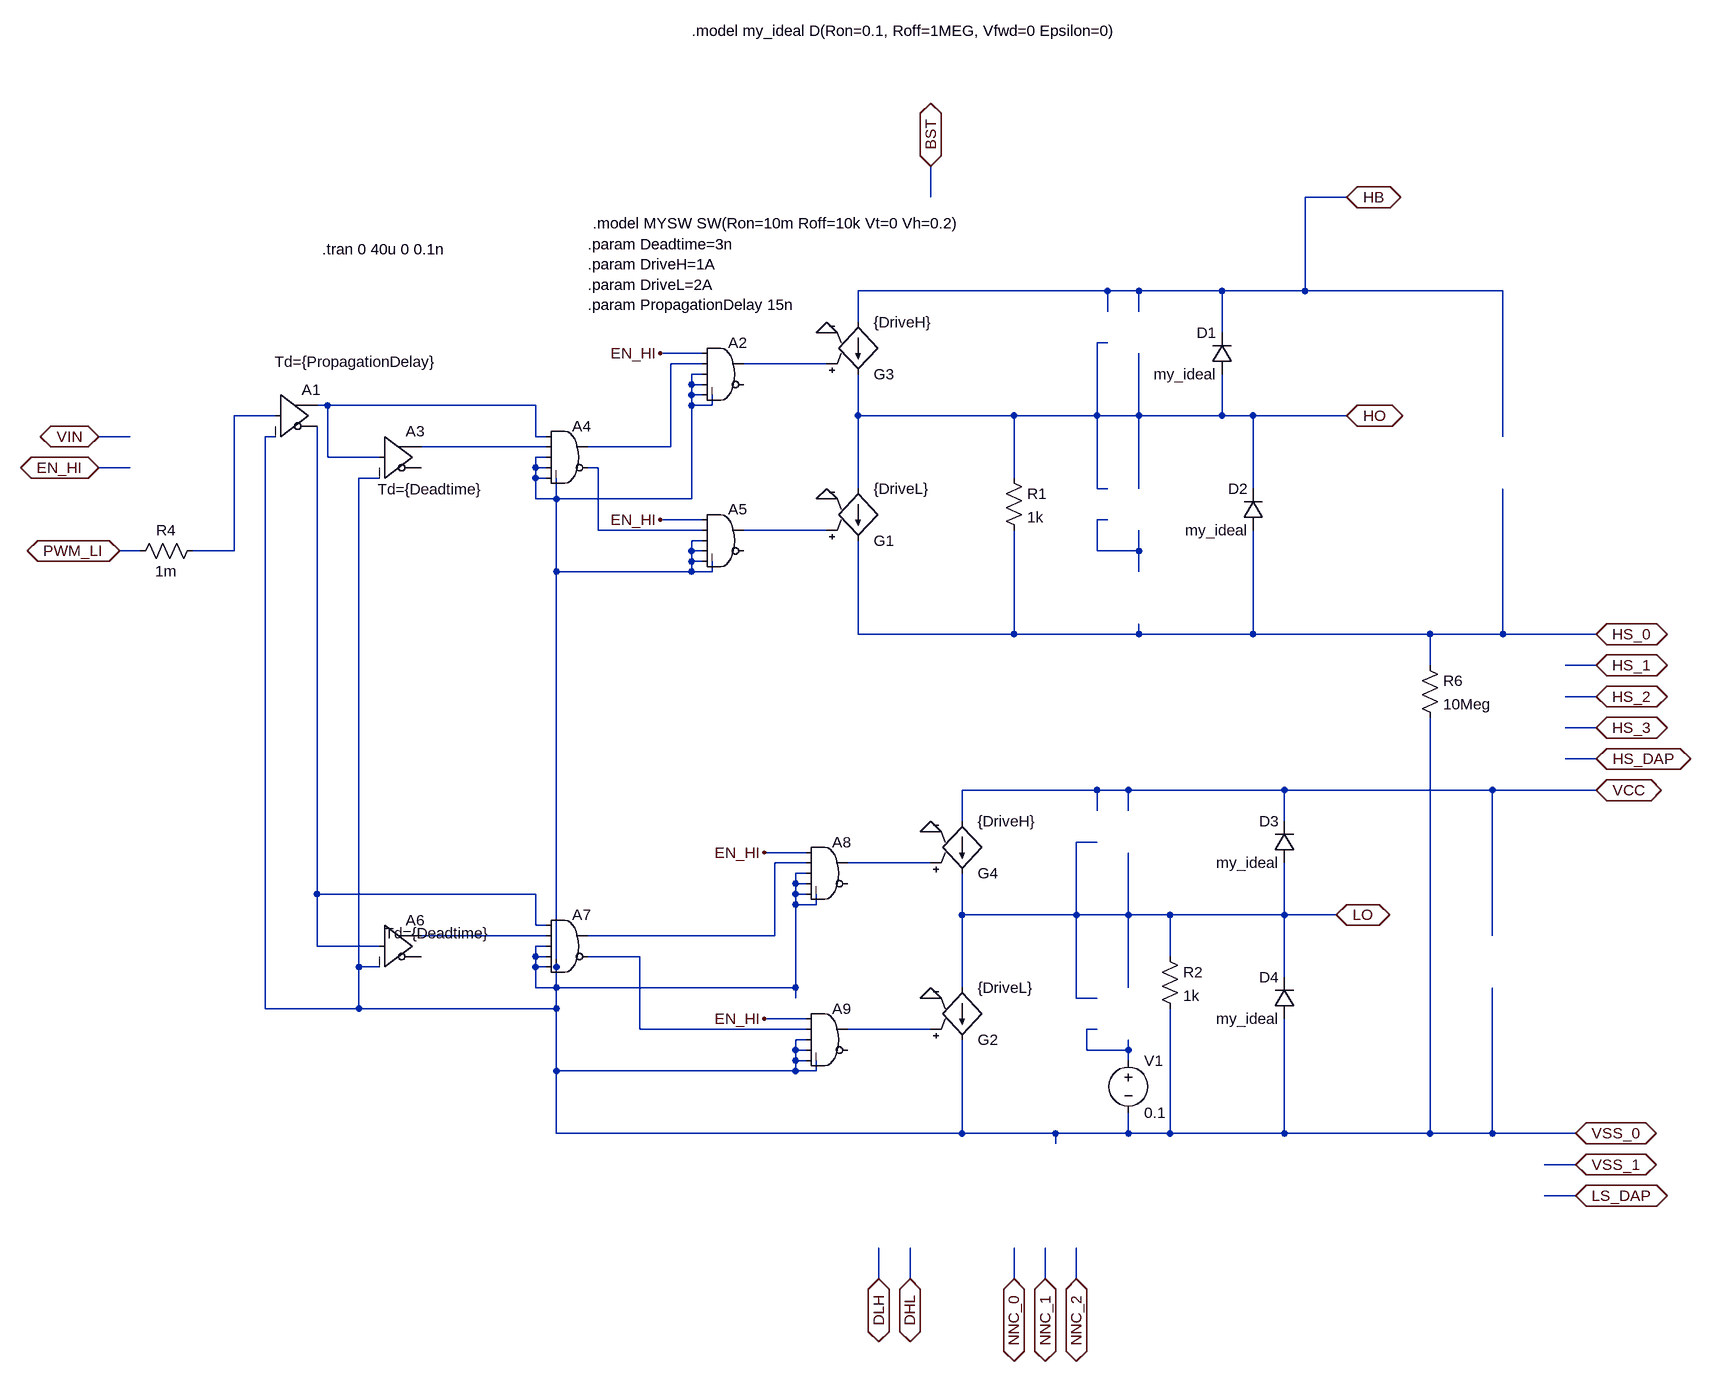
[diagram p0: schematic LMG1210-simple2.asc]
LMG1210-simple2.asc, the LTspice schematic file:
Version 4
SHEET 1 2328 1960
WIRE 912 -288 912 -336
WIRE 1552 -288 1488 -288
WIRE 1184 -144 800 -144
WIRE 1232 -144 1184 -144
WIRE 1360 -144 1232 -144
WIRE 1488 -144 1488 -288
WIRE 1488 -144 1360 -144
WIRE 1792 -144 1488 -144
WIRE 1184 -112 1184 -144
WIRE 1232 -112 1232 -144
WIRE 800 -96 800 -144
WIRE 1360 -80 1360 -144
WIRE 1184 -64 1168 -64
WIRE 560 -48 496 -48
WIRE 560 -32 512 -32
WIRE 752 -32 624 -32
WIRE 560 -16 544 -16
WIRE 544 0 544 -16
WIRE 560 0 544 0
WIRE 544 16 544 0
WIRE 560 16 544 16
WIRE -16 32 -32 32
WIRE 304 32 -16 32
WIRE 544 32 544 16
WIRE 576 32 576 16
WIRE 576 32 544 32
WIRE -96 48 -160 48
WIRE 800 48 800 -16
WIRE 1040 48 800 48
WIRE 1168 48 1168 -64
WIRE 1168 48 1040 48
WIRE 1232 48 1232 -48
WIRE 1232 48 1168 48
WIRE 1360 48 1360 -16
WIRE 1360 48 1232 48
WIRE 1408 48 1360 48
WIRE 1552 48 1408 48
WIRE -320 80 -368 80
WIRE -96 80 -112 80
WIRE 304 80 304 32
WIRE 320 80 304 80
WIRE 1792 80 1792 -144
WIRE 320 96 128 96
WIRE 512 96 512 -32
WIRE 512 96 384 96
WIRE -16 112 -16 32
WIRE 64 112 -16 112
WIRE 320 112 304 112
WIRE -320 128 -368 128
WIRE 304 128 304 112
WIRE 320 128 304 128
WIRE 400 128 384 128
WIRE 64 144 32 144
WIRE 304 144 304 128
WIRE 320 144 304 144
WIRE 1040 144 1040 48
WIRE 800 160 800 48
WIRE 1168 160 1168 48
WIRE 1184 160 1168 160
WIRE 1232 160 1232 48
WIRE 1408 160 1408 48
WIRE 304 176 304 144
WIRE 336 176 336 144
WIRE 336 176 304 176
WIRE 544 176 544 32
WIRE 544 176 336 176
WIRE 560 208 496 208
WIRE 1184 208 1168 208
WIRE 400 224 400 128
WIRE 560 224 400 224
WIRE 752 224 624 224
WIRE 560 240 544 240
WIRE -304 256 -336 256
WIRE -160 256 -160 48
WIRE -160 256 -224 256
WIRE 544 256 544 240
WIRE 560 256 544 256
WIRE 1168 256 1168 208
WIRE 1232 256 1232 224
WIRE 1232 256 1168 256
WIRE 544 272 544 256
WIRE 560 272 544 272
WIRE 336 288 336 176
WIRE 544 288 544 272
WIRE 544 288 336 288
WIRE 576 288 576 272
WIRE 576 288 544 288
WIRE 1232 288 1232 256
WIRE 800 384 800 240
WIRE 1040 384 1040 224
WIRE 1040 384 800 384
WIRE 1232 384 1232 368
WIRE 1232 384 1040 384
WIRE 1408 384 1408 224
WIRE 1408 384 1232 384
WIRE 1680 384 1408 384
WIRE 1792 384 1792 160
WIRE 1792 384 1680 384
WIRE 1936 384 1792 384
WIRE 1680 432 1680 384
WIRE 1936 432 1888 432
WIRE 1936 480 1888 480
WIRE 1936 528 1888 528
WIRE 1936 576 1888 576
WIRE 1168 624 960 624
WIRE 1216 624 1168 624
WIRE 1456 624 1216 624
WIRE 1776 624 1456 624
WIRE 1936 624 1776 624
WIRE 1168 656 1168 624
WIRE 1216 656 1216 624
WIRE 960 672 960 624
WIRE 1456 672 1456 624
WIRE 1168 704 1136 704
WIRE 720 720 656 720
WIRE 720 736 672 736
WIRE 912 736 784 736
WIRE 720 752 704 752
WIRE 704 768 704 752
WIRE 720 768 704 768
WIRE -32 784 -32 64
WIRE 304 784 -32 784
WIRE 704 784 704 768
WIRE 720 784 704 784
WIRE 704 800 704 784
WIRE 736 800 736 784
WIRE 736 800 704 800
WIRE 960 816 960 752
WIRE 1136 816 1136 704
WIRE 1136 816 960 816
WIRE 1216 816 1216 720
WIRE 1216 816 1136 816
WIRE 1280 816 1216 816
WIRE 1456 816 1456 736
WIRE 1456 816 1280 816
WIRE 1536 816 1456 816
WIRE 304 832 304 784
WIRE 320 832 304 832
WIRE 320 848 128 848
WIRE 672 848 672 736
WIRE 672 848 384 848
WIRE 1776 848 1776 624
WIRE -32 864 -32 784
WIRE 64 864 -32 864
WIRE 320 864 304 864
WIRE 304 880 304 864
WIRE 320 880 304 880
WIRE 464 880 384 880
WIRE 1280 880 1280 816
WIRE 32 896 32 144
WIRE 64 896 32 896
WIRE 304 896 304 880
WIRE 320 896 304 896
WIRE 336 896 336 288
WIRE 1456 912 1456 816
WIRE 304 928 304 896
WIRE 336 928 336 896
WIRE 336 928 304 928
WIRE 704 928 704 800
WIRE 704 928 336 928
WIRE 960 928 960 816
WIRE 1216 928 1216 816
WIRE 704 944 704 928
WIRE 1136 944 1136 816
WIRE 1168 944 1136 944
WIRE -112 960 -112 80
WIRE 32 960 32 896
WIRE 32 960 -112 960
WIRE 336 960 336 928
WIRE 336 960 32 960
WIRE 720 976 656 976
WIRE 464 992 464 880
WIRE 720 992 464 992
WIRE 912 992 784 992
WIRE 1168 992 1152 992
WIRE 720 1008 704 1008
WIRE 704 1024 704 1008
WIRE 720 1024 704 1024
WIRE 1152 1024 1152 992
WIRE 1216 1024 1216 1008
WIRE 1216 1024 1152 1024
WIRE 704 1040 704 1024
WIRE 720 1040 704 1040
WIRE 1216 1040 1216 1024
WIRE 336 1056 336 960
WIRE 704 1056 704 1040
WIRE 704 1056 336 1056
WIRE 736 1056 736 1040
WIRE 736 1056 704 1056
WIRE 336 1152 336 1056
WIRE 960 1152 960 1008
WIRE 960 1152 336 1152
WIRE 1104 1152 960 1152
WIRE 1216 1152 1216 1120
WIRE 1216 1152 1104 1152
WIRE 1280 1152 1280 960
WIRE 1280 1152 1216 1152
WIRE 1456 1152 1456 976
WIRE 1456 1152 1280 1152
WIRE 1680 1152 1680 512
WIRE 1680 1152 1456 1152
WIRE 1776 1152 1776 928
WIRE 1776 1152 1680 1152
WIRE 1904 1152 1776 1152
WIRE 1104 1168 1104 1152
WIRE 1904 1200 1856 1200
WIRE 1904 1248 1856 1248
WIRE 832 1376 832 1328
WIRE 880 1376 880 1328
WIRE 1040 1376 1040 1328
WIRE 1088 1376 1088 1328
WIRE 1136 1376 1136 1328
FLAG 1552 48 HO
IOPIN 1552 48 BiDir
FLAG 1936 384 HS_0
IOPIN 1936 384 BiDir
FLAG -336 256 PWM_LI
IOPIN -336 256 BiDir
FLAG 1536 816 LO
IOPIN 1536 816 BiDir
FLAG 1904 1152 VSS_0
IOPIN 1904 1152 BiDir
FLAG 1936 432 HS_1
IOPIN 1936 432 BiDir
FLAG 1936 480 HS_2
IOPIN 1936 480 BiDir
FLAG 1936 528 HS_3
IOPIN 1936 528 BiDir
FLAG 1936 576 HS_DAP
IOPIN 1936 576 BiDir
FLAG 1936 624 VCC
IOPIN 1936 624 BiDir
FLAG 1904 1200 VSS_1
IOPIN 1904 1200 BiDir
FLAG 1904 1248 LS_DAP
IOPIN 1904 1248 BiDir
FLAG 832 1376 DLH
IOPIN 832 1376 BiDir
FLAG 880 1376 DHL
IOPIN 880 1376 BiDir
FLAG -368 80 VIN
IOPIN -368 80 BiDir
FLAG -368 128 EN_HI
IOPIN -368 128 BiDir
FLAG 912 -336 BST
IOPIN 912 -336 BiDir
FLAG 1552 -288 HB
IOPIN 1552 -288 BiDir
FLAG 1040 1376 NNC_0
IOPIN 1040 1376 BiDir
FLAG 1088 1376 NNC_1
IOPIN 1088 1376 BiDir
FLAG 1136 1376 NNC_2
IOPIN 1136 1376 BiDir
FLAG 752 -80 0
FLAG 752 176 0
FLAG 496 -48 EN_HI
FLAG 496 208 EN_HI
FLAG 912 688 0
FLAG 912 944 0
FLAG 656 720 EN_HI
FLAG 656 976 EN_HI
SYMBOL res -208 240 R90
WINDOW 0 0 56 VBottom 2
WINDOW 3 32 56 VTop 2
SYMATTR InstName R4
SYMATTR Value 1m
SYMBOL Digital\\buf -96 -16 R0
WINDOW 3 -1 -19 Left 2
SYMATTR Value Td={PropagationDelay}
SYMATTR InstName A1
SYMBOL Digital\\buf 64 48 R0
WINDOW 3 -3 113 Left 2
SYMATTR Value Td={Deadtime}
SYMATTR InstName A3
SYMBOL Digital\\and 352 48 R0
SYMATTR InstName A4
SYMBOL Digital\\buf 64 800 R0
WINDOW 3 8 44 Left 2
SYMATTR Value Td={Deadtime}
SYMATTR InstName A6
SYMBOL Digital\\and 352 800 R0
SYMATTR InstName A7
SYMBOL res 1664 416 R0
SYMATTR InstName R6
SYMATTR Value 10Meg
SYMBOL g 800 256 M180
SYMATTR InstName G1
SYMATTR Value {DriveL}
SYMBOL voltage 1216 1024 R0
WINDOW 123 0 0 Left 0
WINDOW 39 0 0 Left 0
SYMATTR InstName V1
SYMATTR Value 0.1
SYMBOL diode 1376 -16 R180
WINDOW 0 24 64 Left 2
WINDOW 3 24 0 Left 2
SYMATTR InstName D1
SYMATTR Value my_ideal
SYMBOL diode 1424 224 R180
WINDOW 0 24 64 Left 2
WINDOW 3 24 0 Left 2
SYMATTR InstName D2
SYMATTR Value my_ideal
SYMBOL diode 1472 736 R180
WINDOW 0 24 64 Left 2
WINDOW 3 24 0 Left 2
SYMATTR InstName D3
SYMATTR Value my_ideal
SYMBOL diode 1472 976 R180
WINDOW 0 24 64 Left 2
WINDOW 3 24 0 Left 2
SYMATTR InstName D4
SYMATTR Value my_ideal
SYMBOL g 800 0 M180
SYMATTR InstName G3
SYMATTR Value {DriveH}
SYMBOL Digital\\and 592 -80 R0
SYMATTR InstName A2
SYMBOL Digital\\and 592 176 R0
SYMATTR InstName A5
SYMBOL g 960 1024 M180
SYMATTR InstName G2
SYMATTR Value {DriveL}
SYMBOL g 960 768 M180
SYMATTR InstName G4
SYMATTR Value {DriveH}
SYMBOL Digital\\and 752 688 R0
SYMATTR InstName A8
SYMBOL Digital\\and 752 944 R0
SYMATTR InstName A9
SYMBOL res 1024 128 R0
SYMATTR InstName R1
SYMATTR Value 1k
SYMBOL res 1264 864 R0
SYMATTR InstName R2
SYMATTR Value 1k
TEXT -24 -208 Left 2 !.tran 0 40u 0 0.1n
TEXT 384 -216 Left 2 !.param Deadtime=3n\n.param DriveH=1A\n.param DriveL=2A\n.param PropagationDelay 15n
TEXT 392 -248 Left 2 !.model MYSW SW(Ron=10m Roff=10k Vt=0 Vh=0.2)
TEXT 544 -544 Left 2 !.model my_ideal D(Ron=0.1, Roff=1MEG, Vfwd=0 Epsilon=0)

The netlist it stands for:
* LMG1210-simple2.asc
R4 N004 PWM_LI 1m
A1 N004 VSS_0 VSS_0 VSS_0 VSS_0 N011 N003 VSS_0 BUF Td={PropagationDelay}
A3 N003 VSS_0 VSS_0 VSS_0 VSS_0 VSS_0 N005 VSS_0 BUF Td={Deadtime}
A4 N003 N005 VSS_0 VSS_0 VSS_0 N006 N001 VSS_0 AND
A6 N011 VSS_0 VSS_0 VSS_0 VSS_0 VSS_0 N012 VSS_0 BUF Td={Deadtime}
A7 N011 N012 VSS_0 VSS_0 VSS_0 N013 N009 VSS_0 AND
R6 HS_0 VSS_0 10Meg
G1 HO HS_0 N008 0 {DriveL}
V1 N015 VSS_0 0.1
D1 HO HB my_ideal
D2 HS_0 HO my_ideal
D3 LO VCC my_ideal
D4 VSS_0 LO my_ideal
G3 HB HO N002 0 {DriveH}
A2 EN_HI N001 VSS_0 VSS_0 VSS_0 VSS_0 N002 VSS_0 AND
A5 EN_HI N006 VSS_0 VSS_0 VSS_0 VSS_0 N008 VSS_0 AND
G2 LO VSS_0 N014 0 {DriveL}
G4 VCC LO N010 0 {DriveH}
A8 EN_HI N009 VSS_0 VSS_0 VSS_0 VSS_0 N010 VSS_0 AND
A9 EN_HI N013 VSS_0 VSS_0 VSS_0 VSS_0 N014 VSS_0 AND
R1 HO HS_0 1k
R2 LO VSS_0 1k
.model D D
.lib standard.dio
.tran 0 40u 0 0.1n
.param Deadtime=3n
.param DriveH=1A
.param DriveL=2A
.param PropagationDelay 15n
.model MYSW SW(Ron=10m Roff=10k Vt=0 Vh=0.2)
.model my_ideal D(Ron=0.1, Roff=1MEG, Vfwd=0 Epsilon=0)
.backanno
.end